# EAGLE design LB_BIT_i12_TEMPSENSOR-v02(rev1) (EAGLE 6.1)
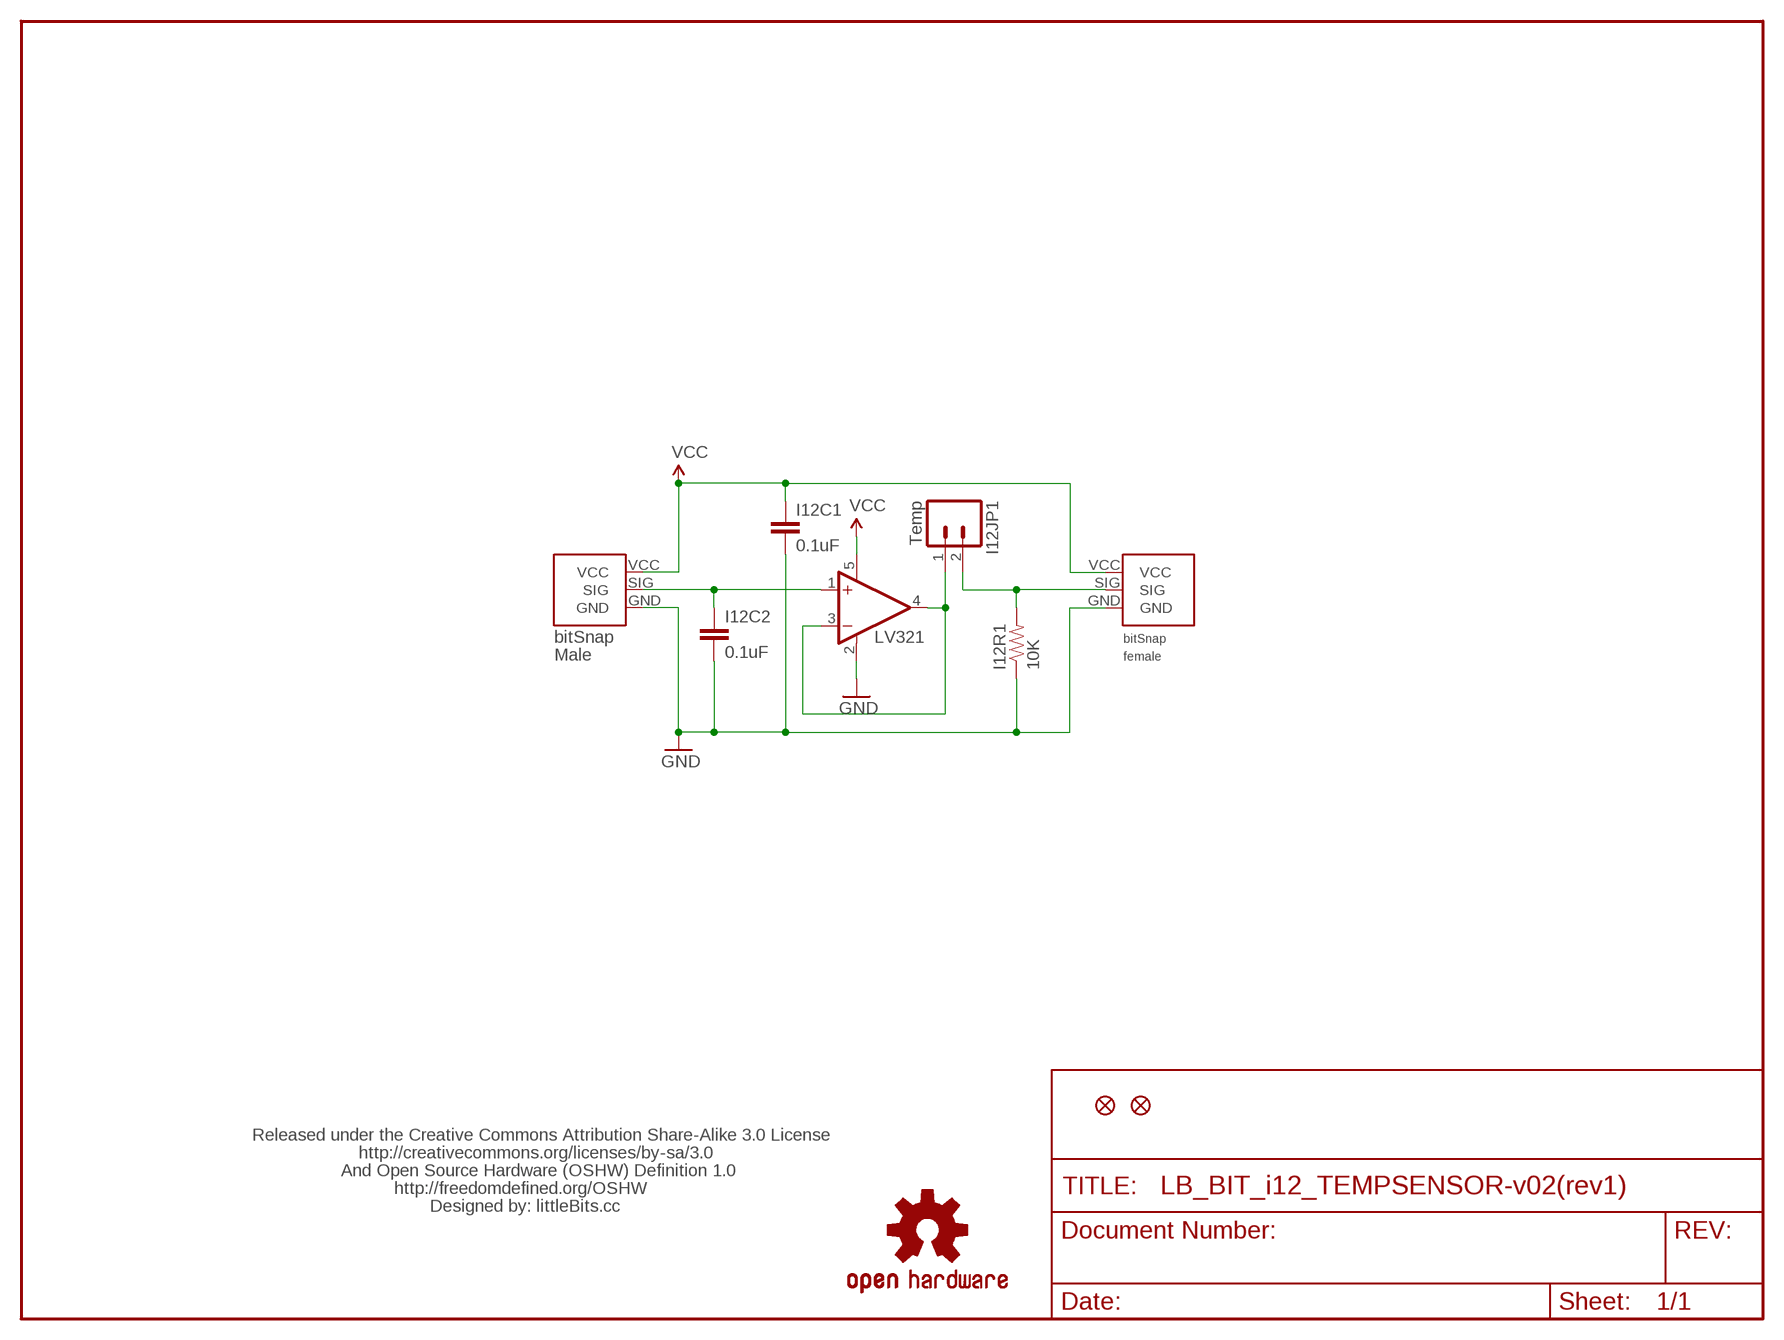
[diagram p0: schematic, sheet 1]

## Parts
I12BSF  BITSNAP_FEMALE  [BITSNAP_FEMALE]
I12BSM  BITSNAP_MALE  [BITSNAP_MALE]
I12C1  0.1uF  CAP0603-CAP  [0603-CAP]
I12C2  0.1uF  CAP0603-CAP  [0603-CAP]
I12JP1  Temp  M02PTH  [1X02]
I12R1  10K  RESISTOR0603-RES  [0603-RES]
I12U1  LV321  [SC70]
JP2  FIDUCIAL1X2  [FIDUCIAL-1X2]
JP3  FIDUCIAL1X2  [FIDUCIAL-1X2]
U$1  OSHW-LOGOL  [OSHW-LOGO-L]
U$18  LB_CREDITS_V2  [LB_CREDITS_V2]

## Nets
GND: I12BSF.GND I12BSM.GND I12C1.2 I12C2.2 I12R1.1 I12U1.2(V-)
N$6: I12JP1.1 I12U1.3(-IN) I12U1.4(OUT)
PS: I12BSF.SIG I12JP1.2 I12R1.2
SIG: I12BSM.SIG I12C2.1 I12U1.1(+IN)
VCC: I12BSF.VCC I12BSM.VCC I12C1.1 I12U1.5(V+)

## Library data of the parts
I12BSF = bitSnap:BITSNAP_FEMALE
I12BSM = bitSnap:BITSNAP_MALE
I12C1 I12C2 = SparkFun:CAP: Capacitor Standard 0603 ceramic capacitor, and 0.1" leaded capacitor.
I12JP1 = SparkFun:M02: Header 2 Standard 2-pin 0.1" header. Use with straight break away headers (SKU : PRT-00116), right angle break away headers (PRT-00553), swiss pins (PRT-00743), machine pins (PRT-00117), and female headers (PRT-00115). Molex polarized connector foot print use with SKU : PRT-08233 with associated crimp pins and housings.
I12R1 = SparkFun:RESISTOR: Resistor Basic schematic elements and footprints for 0603, 1206, and PTH 1/10th watt (small) resistors.
I12U1 = LITTLEBITS:LV321
JP2 JP3 = SparkFun:FIDUCIAL: Fiducial Alignment Points Various fiducial points for machine vision alignment.
U$1 = SparkFun_NEW:OSHW-LOGO: Open Source Hardware Logo This logo indicates the piece of hardware it is found on incorporates a OSHW license and/or adheres to the definition of open source hardware found here: http://freedomdefined.org/OSHW
U$18 = LITTLEBITS:LB_CREDITS_V2

## Board
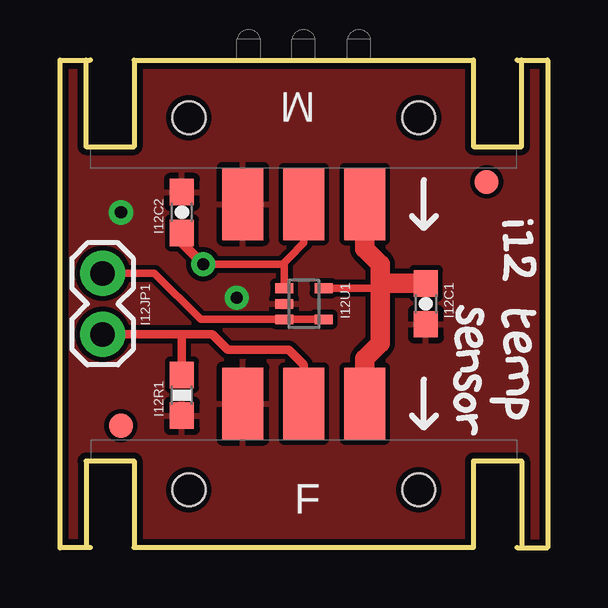
[diagram p1: board, top side]
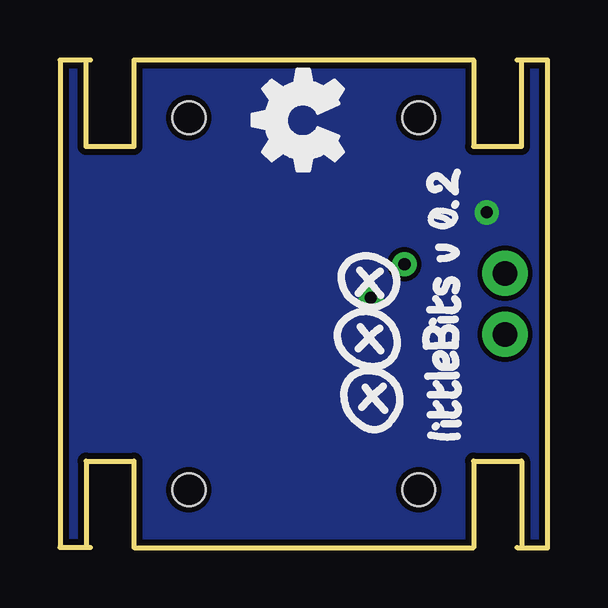
[diagram p2: board, bottom side, seen from below]

Size 20.32 x 20.33 mm. Coordinates in mm from the lower left corner, seen from the top.
Outline: 0,0 0,0.01
Outline: 0,0.01 0,20.33 1.27,20.33
Outline: 19.05,20.33 20.32,20.33 20.32,0.01 19.05,0.01
Outline: 1.27,0.01 0,0.01
Copper layers (1*16): Top 0.035mm / dielectric 1.5mm / Bottom 0.035mm
Design rules: minimum track width 8mil, minimum drill 20mil, track to track 8mil, track to pad 8mil, pad to pad 8mil, via to via 8mil, smd to smd 8mil, copper to edge 10mil, drill to drill 8mil, minimum pad ring 12mil, minimum via ring 10mil, stop-mask expansion 4mil, vias tented up to drill 25mil, thermal gap 10mil

### Footprints (pad centres in the part's own frame; a part is rotated, then mirrored left to right if it is on the bottom)
BITSNAP_FEMALE = smd 1.7 x 3: GND 6.35,6; SIG 8.89,6; VCC 11.43,6 | hole 1.37: 13.68,2.41; 4.1,2.41
BITSNAP_MALE = smd 1.7 x 3: GND 11.43,6; SIG 8.89,6; VCC 6.35,6 | hole 1.37: 13.68,2.41; 4.1,2.41
0603-CAP = smd 1.1 x 1: 1 -0.85,0; 2 0.85,0
1X02 = drill 1.016 pad 1.88: 1 0,0; 2 2.54,0
0603-RES = smd 1.1 x 1: 1 -0.85,0; 2 0.85,0
SC70 = smd 0.4 x 0.75: 1 -0.65,-0.825; 2 0,-0.825; 3 0.65,-0.825; 4 0.65,0.825; 5 -0.65,0.825
FIDUCIAL-1X2 = smd 1 x 1: 1 0,0

### Placement (x,y rotation side)
I12BSF  1.27,0.01 0 top
I12BSM  19.05,20.33 180 top
I12C1  15.24,10.17 270 top
I12C2  5.08,13.98 90 top
I12JP1  1.78,11.44 270 top
I12R1  5.08,6.36 90 top
I12U1  10.16,10.17 270 top
JP2  2.54,5.09 0 top
JP3  17.78,15.25 0 top
U$1  -13.97,-10.15 0 top  (outside the outline)
U$2  [I]  18.29,13.8 270 top
U$3  [1]  18.41,13.29 270 top
U$5  [LB_V02]  2.41,3.57 0 top
U$6  [OSHW_FILLX150_NOTEXT]  8.51,14.87 0 top
U$7  [2]  18.29,12.41 270 top
U$8  [T]  18.29,10.12 270 top
U$9  [E]  18.29,9.23 270 top
U$10  [M]  18.54,8.21 270 top
U$11  [P]  17.65,6.44 270 top
U$12  [S]  16.38,10.25 270 top
U$13  [E]  16.26,9.43 270 top
U$14  [N]  16.46,8.29 270 top
U$15  [S]  16.28,7.48 270 top
U$16  [O]  16.31,6.64 270 top
U$17  [R]  16.31,5.83 270 top
U$18  -1.27,-12.69 0 top  (outside the outline)

### Tracks (layer width: path | path; a pad name or v marks a point on that pad's centre or on a via)
GND  (via drill 0.51)
  other vias: 7.37,10.42 2.54,13.98
  pour Bottom: 0,20.33 0,0.01 20.32,0.01 20.32,20.33
  pour Top: 0,20.33 0,0.01 20.32,0.01 20.32,20.33
N$6
  Top 0.305: I12JP1.1 3.94,11.44 5.86,9.52 I12U1.3 I12U1.4
PS
  Top 0.356: I12JP1.2 5.08,8.9 | 5.08,8.9 6.35,8.9 6.99,8.27 9.53,8.27 10.16,7.63 I12BSF.SIG | 5.08,8.9 I12R1.2
SIG  (via drill 0.51)
  Top 0.305: v5.97,11.82 9.27,11.82 9.34,11.88 | I12BSM.SIG 10.16,12.71 9.53,12.07 9.34,11.88 | 9.34,11.88 I12U1.1
  Top 0.406: v5.97,11.82 5.08,12.71 I12C2.1
VCC
  Top 0.305: I12U1.5 13.22,10.82 13.34,10.93
  Top 0.813: I12BSM.VCC 12.7,12.46 13.34,11.82 13.34,11.19 | 13.34,10.93 13.34,8.52 12.7,7.88 I12BSF.VCC | 13.34,10.93 13.34,11.19 | 13.34,11.19 13.4,11.12 | I12C1.1 13.42,11.02 13.34,10.93

### Text on the board
tValues: Temp